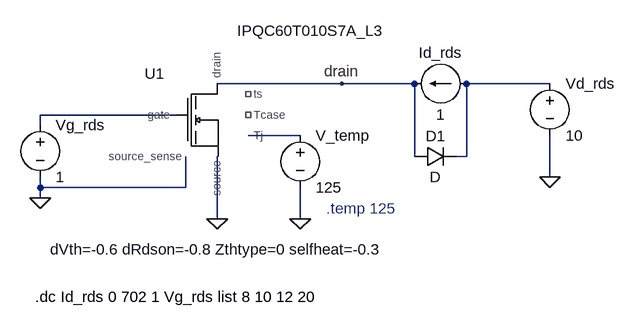
[diagram p0: schematic Si_MOSFET_Rds.asc]
Si_MOSFET_Rds.asc, the LTspice schematic file:
Version 4.1
SHEET 1 888 1272
WIRE 384 112 192 112
WIRE 496 112 384 112
WIRE 704 112 576 112
WIRE 128 160 -80 160
WIRE -80 176 -80 160
WIRE 320 192 240 192
WIRE 496 224 496 112
WIRE 576 224 576 112
WIRE 576 224 560 224
WIRE 704 256 704 192
WIRE -80 272 -80 256
WIRE 144 272 144 224
WIRE 144 272 -80 272
WIRE -80 288 -80 272
WIRE 192 320 192 224
WIRE 320 320 320 272
FLAG -80 288 0
FLAG 192 320 0
FLAG 320 320 0
FLAG 704 256 0
FLAG 384 112 drain
SYMBOL IPQC60T010S7_L3 192 176 R0
WINDOW 3 144 -161 Top 2
SYMATTR InstName U1
SYMATTR SpiceLine dVth=-0.6 dRdson=-0.8 Zthtype=0 selfheat=-0.3
SYMBOL voltage -80 160 R0
WINDOW 123 0 0 Left 0
WINDOW 39 0 0 Left 0
SYMATTR InstName Vg_rds
SYMATTR Value 1
SYMBOL voltage 320 176 R0
WINDOW 123 0 0 Left 0
WINDOW 39 0 0 Left 0
SYMATTR InstName V_temp
SYMATTR Value 125
SYMBOL current 576 112 R90
WINDOW 0 -32 40 VBottom 2
WINDOW 3 32 40 VTop 2
WINDOW 123 0 0 Left 0
WINDOW 39 0 0 Left 0
SYMATTR InstName Id_rds
SYMATTR Value 1
SYMBOL diode 496 240 R270
WINDOW 0 32 32 VTop 2
WINDOW 3 0 32 VBottom 2
SYMATTR InstName D1
SYMBOL voltage 704 96 R0
SYMATTR InstName Vd_rds
SYMATTR Value 10
TEXT 360 304 Left 2 ;.temp 125
TEXT -88 440 Left 2 !.dc Id_rds 0 702 1 Vg_rds list 8 10 12 20

The netlist it stands for:
* Si_MOSFET_Rds.asc
X§U1 drain N002 0 0 NC_01 N003 NC_02 IPQC60T010S7A_L3 dVth=-0.6 dRdson=-0.8 Zthtype=0 selfheat=-0.3  ; pins drain gate source source_sense ts Tj Tcase
Vg_rds N002 0 1
V_temp N003 0 125
Id_rds N001 drain 1
D1 drain N001 D
Vd_rds N001 0 10
.model D D
.lib standard.dio
* .temp 125
.dc Id_rds 0 702 1 Vg_rds list 8 10 12 20
.lib IFX_S7A_TS_600V.lib
.backanno
.end